# Altium schematic sheet Sheet7.SchDoc
size A4
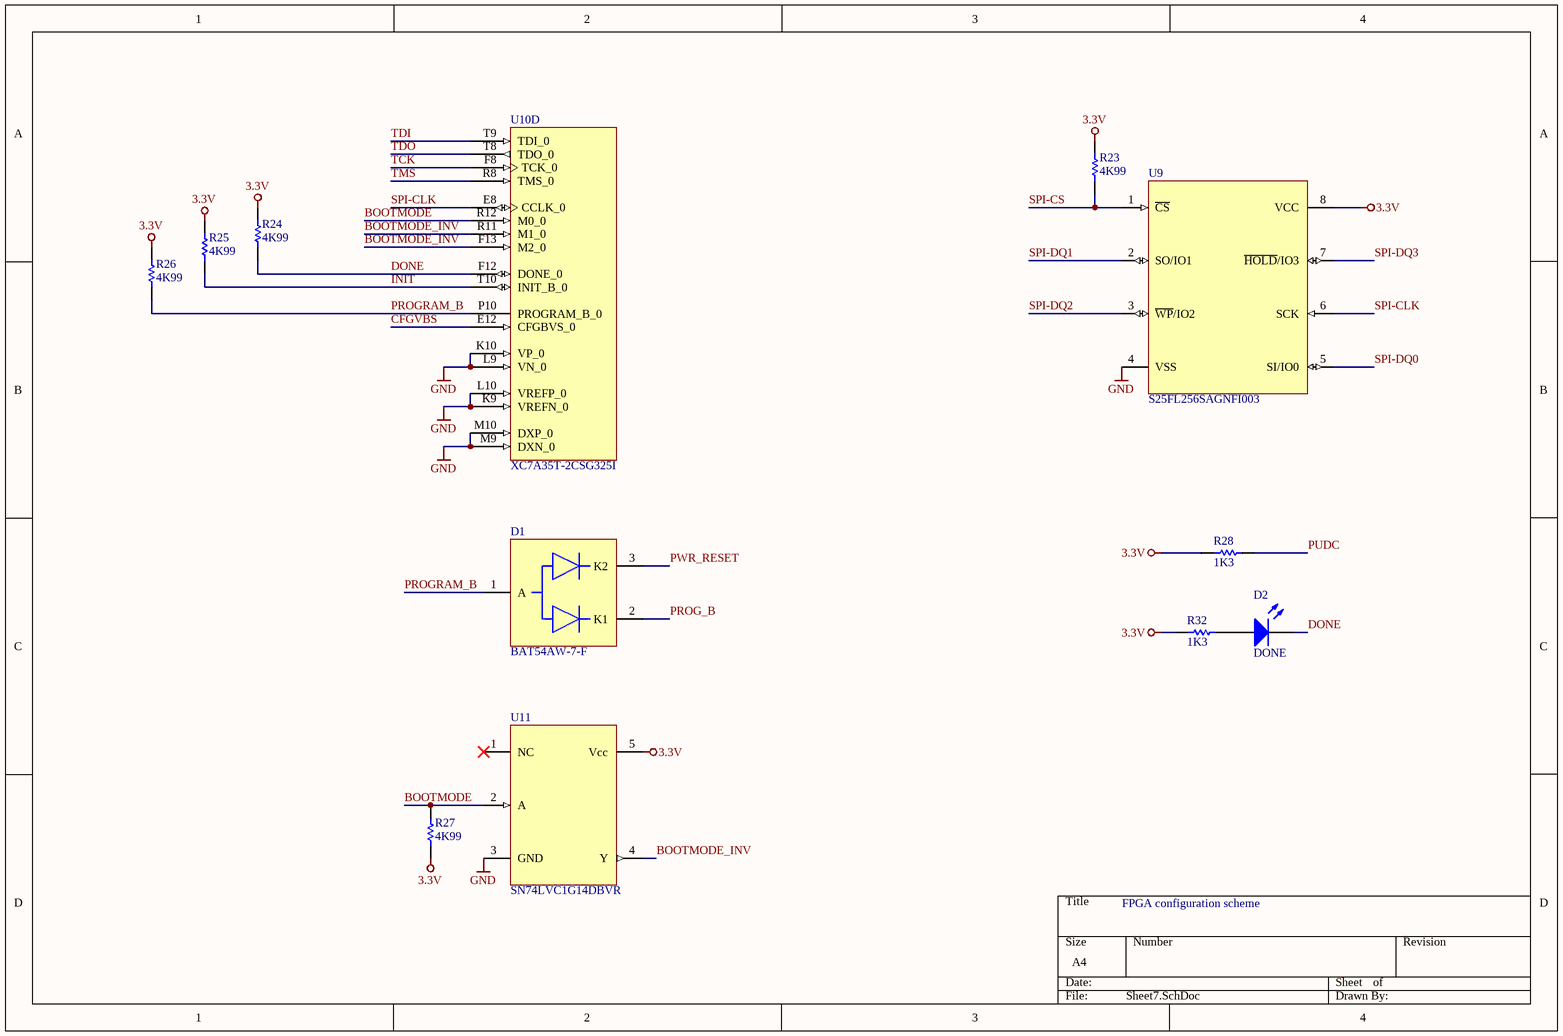
[diagram p0: Sheet7.SchDoc]

## Parts
D1  BAT54AW-7-F  [BAT54AW-7-F]
D2  DONE  [LEDC2012X10N]
R23  4K99  [RESC1005X05N]
R24  4K99  [RESC1005X05N]
R25  4K99  [RESC1005X05N]
R26  4K99  [RESC1005X05N]
R27  4K99  [RESC1005X05N]
R28  1K3  [RESC1005X05N]
R32  1K3  [RESC1005X05N]
U9  S25FL256SAGNFI003  [S25FL256SAGNFI003]
U10  XC7A35T-2CSG325I  [XC7A35T-2CSG325I]  (part D of 9)
U11  SN74LVC1G14DBVR  [SN74LVC1G14DBVR]

## Nets
3.3V: R23.1 R24.1 R25.1 R26.1 R27.1 R28.2 R32.2 U9.8(VCC) U11.5(Vcc)
GND: U9.4(VSS) U10.K9(VREFN_0) U10.K10(VP_0) U10.L9(VN_0) U10.L10(VREFP_0) U10.M9(DXN_0) U10.M10(DXP_0) U11.3(GND)
BOOTMODE: R27.2 U10.R12(M0_0) U11.2(A)
BOOTMODE_INV: U10.F13(M2_0) U10.R11(M1_0) U11.4(Y)
CFGVBS: U10.E12(CFGBVS_0)
DONE: D2.1(K) R24.2 U10.F12(DONE_0)
INIT: R25.2 U10.T10(INIT_B_0)
PROG_B: D1.2(K1)
PROGRAM_B: D1.1(A) R26.2 U10.P10(PROGRAM_B_0)
PUDC: R28.1
PWR_RESET: D1.3(K2)
SPI-CLK: U9.6(SCK) U10.E8(CCLK_0)
SPI-CS: R23.2 U9.1(~{CS})
SPI-DQ0: U9.5(SI/IO0)
SPI-DQ1: U9.2(SO/IO1)
SPI-DQ2: U9.3(~{WP}/IO2)
SPI-DQ3: U9.7(~{HOLD}/IO3)
TCK: U10.F8(TCK_0)
TDI: U10.T9(TDI_0)
TDO: U10.T8(TDO_0)
TMS: U10.R8(TMS_0)
NetD2_2: D2.2(A) R32.1

Not connected (* = marked no-connect by the designer): U11 1(NC)*

## Notes on the sheet
- FPGA configuration scheme

## Library data of the parts
D1 = BAT54AW-7-F: SCHOTTKY BARRIER DIODE
D2 = LED0805: SMD chip LED; Text: DONE
R23-R28 R32 = R0402: Ceramic Chip Resistor
  R23-R27: Value: 4K99
  R28 R32: Value: 1K3
U9 = S25FL256SAGNFI003: 256 Mbit (32 Mbyte)  3.0V SPI Flash Memory
U10 = XC7A35T-2CSG325I: Artix-7 FPGA, 150 User I/Os, 4 GTP, 324-Ball BGA, Speed Grade 2, Industrial Grade, Pb-Free; Manufacturer: Xilinx; Total Block RAM: 1800 Kb; GTP: 4; Clock Mgmt Tiles (CMTs): 5; Logic Cells: 33280; Available User I/O: 150; Speed Grades: 2; DatasheetVersion: v1.15; PackageVersion: Rev. 1.11; PackageReference: CSG-325; PackageDescription: 324-Ball Wire-Bond Chip-Scale BGA, Body 15 x 15 mm, Pitch 0.8 mm; Maximum Distributed RAM: 400 Kb; Operating Temperature Range: Industrial; NexusDeviceID: XC7A35T-2CSG325I; Mounting Technology: Surface Mount; PartNumber: XC7A35T-2CSG325I; ComponentLink1Description: Manufacturer URL; ComponentLink1URL: http://www.xilinx.com/; ComponentLink2Description: Datasheet; ComponentLink2URL: http://www.xilinx.com/support/documentation/data_sheets/ds180_7Series_Overview.pdf; ComponentLink3Description: Package Specification; ComponentLink3URL: http://www.xilinx.com/support/documentation/user_guides/ug475_7Series_Pkg_Pinout.pdf; ComponentLink4Description: DC and Switching Characteristics; ComponentLink4URL: http://www.xilinx.com/support/documentation/data_sheets/ds181_Artix_7_Data_Sheet.pdf; ComponentLink5Description: Package File; ComponentLink5URL: http://www.xilinx.com/support/packagefiles/a7packages/xc7a200tsbg484pkg.txt; ComponentLink6Description: Packaging and Pinout; ComponentLink6URL: http://www.xilinx.com/support/documentation/user_guides/ug475_7Series_Pkg_Pinout.pdf
U11 = SN74LVC1G14DBVR: Single Schmitt-Trigger Inverter